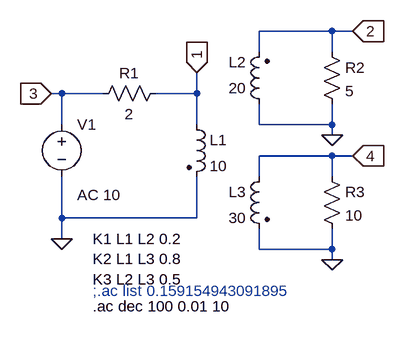
[diagram p0: schematic test_11.asc]
test_11.asc, the LTspice schematic file:
Version 4
SHEET 1 880 680
WIRE 224 -224 112 -224
WIRE 256 -224 224 -224
WIRE 112 -192 112 -224
WIRE 224 -192 224 -224
WIRE -192 -128 -208 -128
WIRE -128 -128 -192 -128
WIRE 16 -128 16 -160
WIRE 16 -128 -48 -128
WIRE -192 -80 -192 -128
WIRE 16 -80 16 -128
WIRE 112 -80 112 -112
WIRE 224 -80 224 -112
WIRE 224 -80 112 -80
WIRE 224 -64 224 -80
WIRE 224 -32 112 -32
WIRE 256 -32 224 -32
WIRE 112 0 112 -32
WIRE 224 0 224 -32
WIRE -192 64 -192 0
WIRE 16 64 16 0
WIRE 16 64 -192 64
WIRE -192 96 -192 64
WIRE 112 112 112 80
WIRE 224 112 224 80
WIRE 224 112 112 112
WIRE 224 128 224 112
FLAG -192 96 0
FLAG 224 -64 0
FLAG 224 128 0
FLAG 16 -160 1
IOPIN 16 -160 In
FLAG 256 -224 2
IOPIN 256 -224 In
FLAG 256 -32 4
IOPIN 256 -32 In
FLAG -208 -128 3
IOPIN -208 -128 In
SYMBOL ind2 0 -96 R0
SYMATTR InstName L1
SYMATTR Value 10
SYMATTR Type ind
SYMATTR SpiceLine Rser=0
SYMBOL ind2 128 -96 R180
WINDOW 0 36 80 Left 2
WINDOW 3 36 40 Left 2
SYMATTR InstName L2
SYMATTR Value 20
SYMATTR Type ind
SYMATTR SpiceLine Rser=0
SYMBOL ind2 128 -16 M0
SYMATTR InstName L3
SYMATTR Value 30
SYMATTR Type ind
SYMATTR SpiceLine Rser=0
SYMBOL res 208 -208 R0
SYMATTR InstName R2
SYMATTR Value 5
SYMBOL res 208 -16 R0
SYMATTR InstName R3
SYMATTR Value 10
SYMBOL res -32 -144 R90
WINDOW 0 0 56 VBottom 2
WINDOW 3 32 56 VTop 2
SYMATTR InstName R1
SYMATTR Value 2
SYMBOL voltage -192 -96 R0
WINDOW 123 24 124 Left 2
WINDOW 39 0 0 Left 0
SYMATTR Value2 AC 10
SYMATTR InstName V1
SYMATTR Value ""
TEXT -144 96 Left 2 !K1 L1 L2 0.2\nK2 L1 L3 0.8\nK3 L2 L3 0.5
TEXT -144 176 Left 2 ;;.ac list 0.159154943091895
TEXT -144 200 Left 2 !.ac dec 100 0.01 10

The netlist it stands for:
* test_11.asc
L1 1 0 10 Rser=0
L2 0 2 20 Rser=0
L3 4 0 30 Rser=0
R2 2 0 5
R3 4 0 10
R1 1 3 2
V1 3 0 AC 10
K1 L1 L2 0.2
K2 L1 L3 0.8
K3 L2 L3 0.5
* ;.ac list 0.159154943091895
.ac dec 100 0.01 10
.backanno
.end